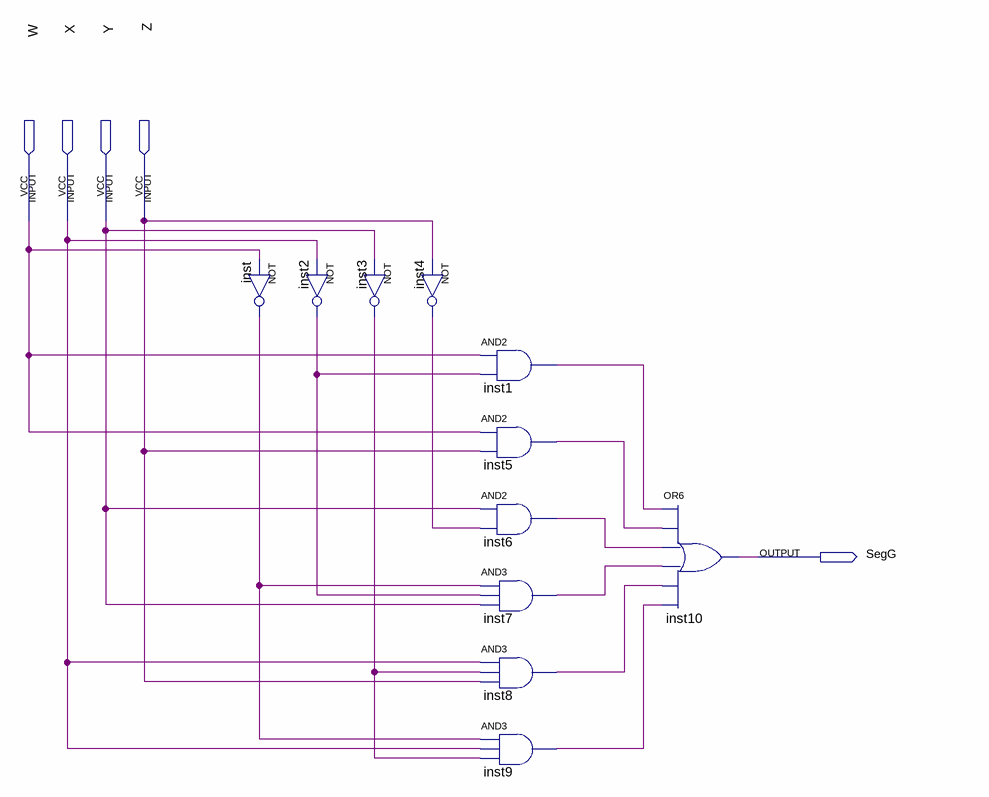
[diagram p0: schematic sheet]
// Quartus schematic SegG.bdf as structural Verilog: 11 symbols, 5 pins
module SegG (
  input  W,
  input  X,
  input  Y,
  input  Z,
  output SegG
);

  wire inst1_out, inst2_out, inst3_out, inst4_out, inst5_out, inst6_out, inst7_out, inst8_out, inst9_out,
       inst_out;

  not inst (inst_out, W);
  not inst2 (inst2_out, X);
  not inst3 (inst3_out, Y);
  not inst4 (inst4_out, Z);
  and inst1 (inst1_out, W, inst2_out);
  and inst5 (inst5_out, W, Z);
  and inst6 (inst6_out, Y, inst4_out);
  and inst7 (inst7_out, inst_out, inst2_out, Y);
  and inst8 (inst8_out, X, inst3_out, Z);
  and inst9 (inst9_out, inst_out, X, inst3_out);
  or inst10 (SegG, inst1_out, inst5_out, inst6_out, inst7_out, inst8_out, inst9_out);
endmodule
